# EAGLE design AST1021 (EAGLE 6.3)
DATABASE: ./../../../../../Components/TinyCircuits_Part_Database.txt
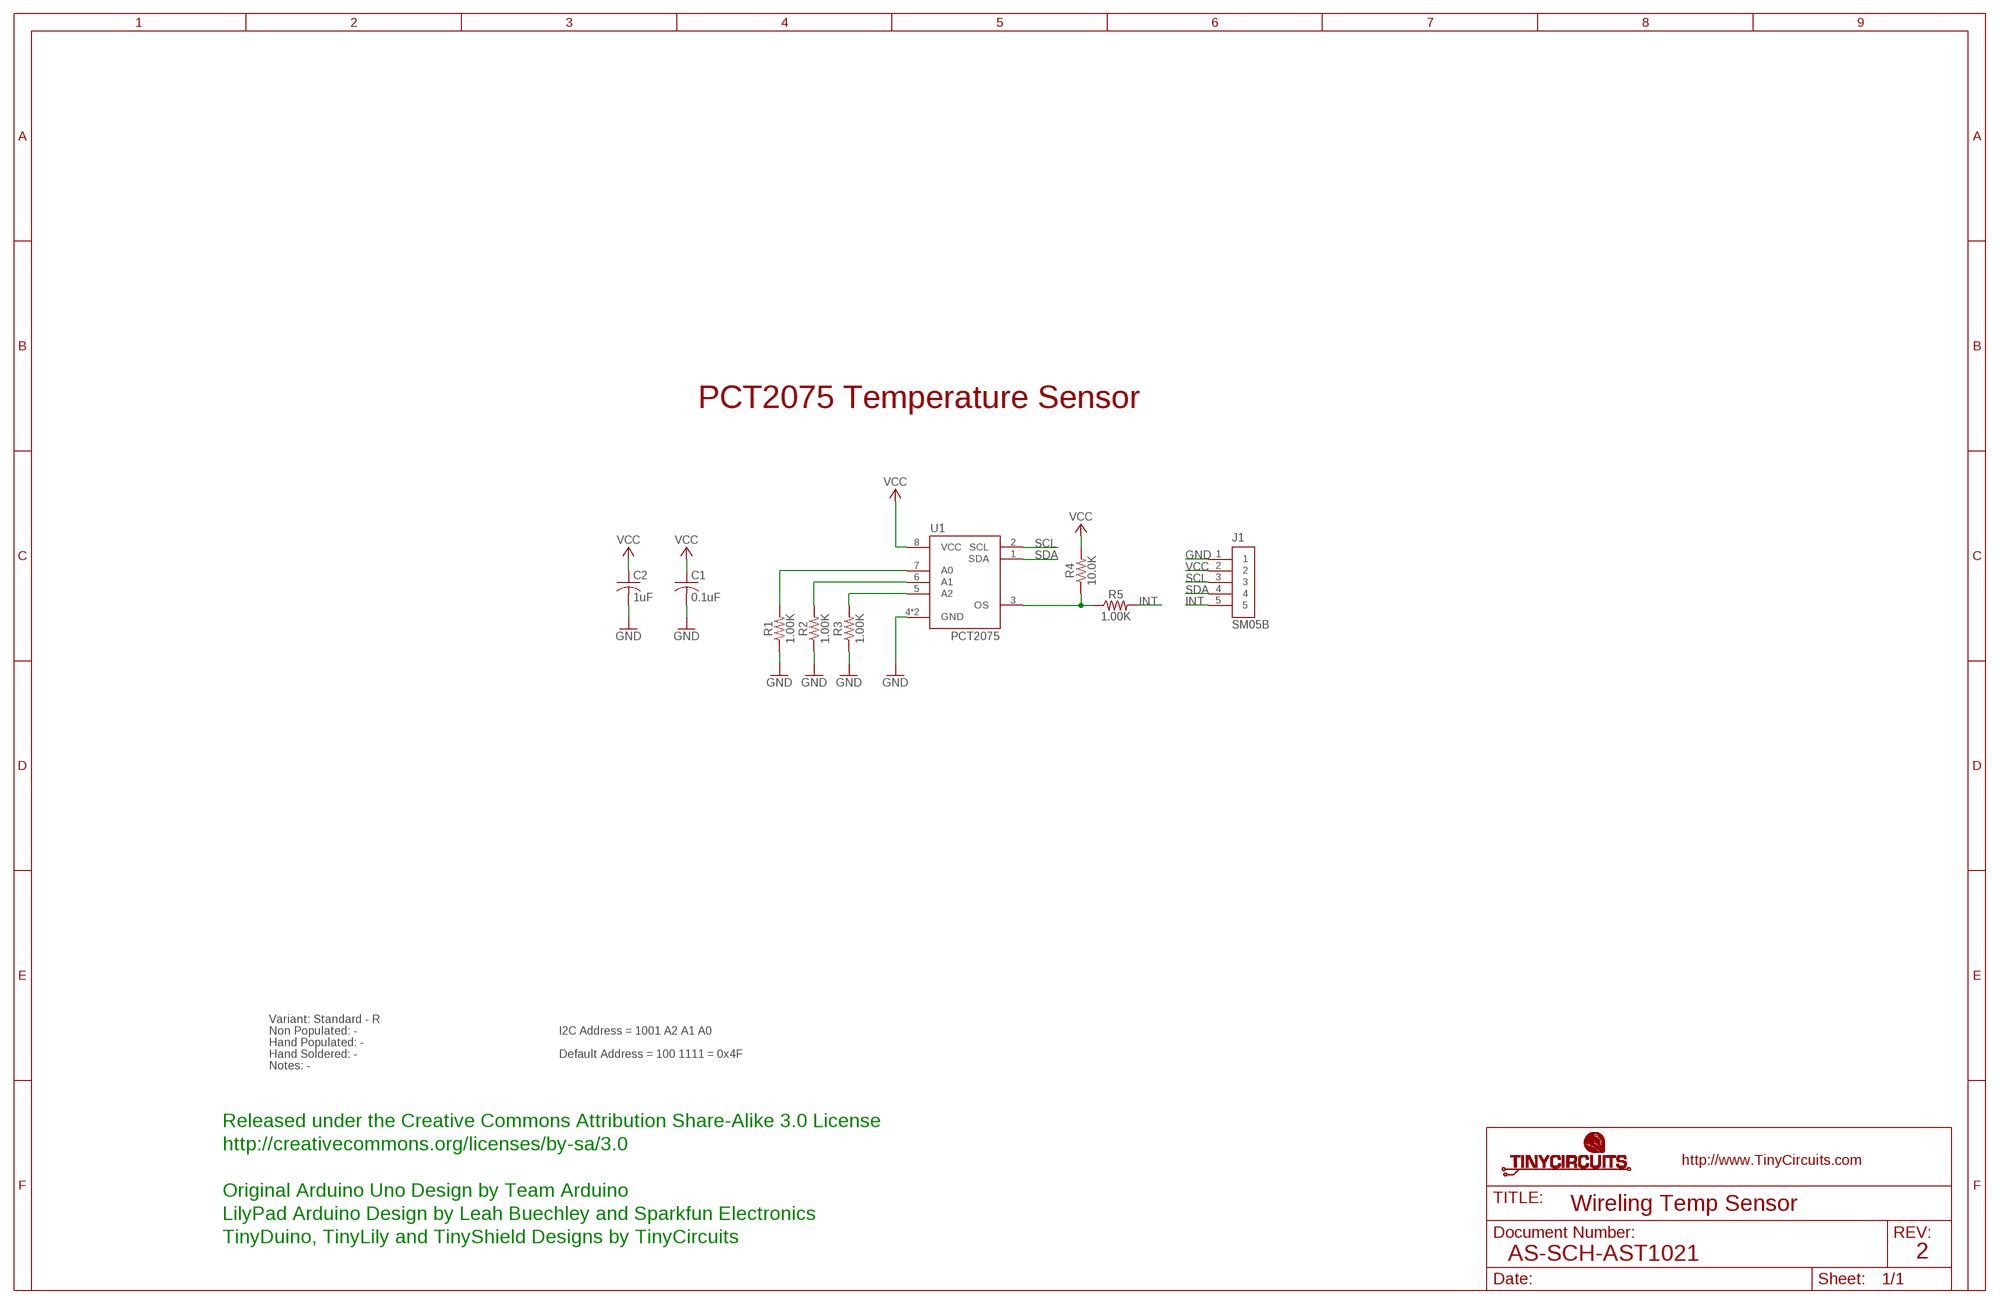
[diagram p0: schematic, sheet 1]

## Parts
C1  0.1uF  AS-ITM-00008  [C0402]
C2  1uF  AS-ITM-00410  [C0603]
J1  SM05B  AS-ITM-00340EDGE  [JST_SH_5X1_EDGE]
R1  1.00K  AS-ITM-00003  [0402]
R2  1.00K  AS-ITM-00003  [0402]
R3  1.00K  AS-ITM-00003  [0402]
R4  10.0K  AS-ITM-00032  [0402]
R5  1.00K  AS-ITM-00003  [0402]
U1  PCT2075  AS-ITM-00325  [HWSON-8]

## Nets
GND: C1.2 C2.2 J1.1 R1.1 R2.1 R3.1 U1.4(GND) U1.GND
GPIO1: R4.1 R5.1 U1.3(OS)
INT: J1.5 R5.2
N$1: R1.2 U1.7(A0)
N$2: R2.2 U1.6(A1)
N$5: R3.2 U1.5(A2)
SCL: J1.3 U1.2(SCL)
SDA: J1.4 U1.1(SDA)
VCC: C1.1 C2.1 J1.2 R4.2 U1.8(VCC)

## Notes on the sheet
- PCT2075 Temperature Sensor
- Variant: Standard - R
- Non Populated: - | I2C Address = 1001 A2 A1 A0
- Hand Populated: -
- Hand Soldered: - | Default Address = 100 1111 = 0x4F
- Notes: -
- Released under the Creative Commons Attribution Share-Alike 3.0 License
- http://creativecommons.org/licenses/by-sa/3.0
- Original Arduino Uno Design by Team Arduino
- Wireling Temp Sensor
- LilyPad Arduino Design by Leah Buechley and Sparkfun Electronics
- TinyDuino, TinyLily and TinyShield Designs by TinyCircuits
- AS-SCH-AST1021 | 2

## Library data of the parts
C1 = tinycircuits:AS-ITM-00008: CAP CER 0.1UF 16V 10% X5R 0402; PARTNO: AS-ITM-00008
C2 = tinycircuits:AS-ITM-00410: CAP CER 1UF 10V X5R 0603; PARTNO: AS-ITM-00410
J1 = tinycircuits:AS-ITM-00340: CONN HEADER SH 5POS SIDE 1MM TIN; PARTNO: AS-ITM-00340; PNPROTATION: 180
R1-R3 R5 = tinycircuits:AS-ITM-00003: RES 1.00K OHM 1/16W 1% 0402; PARTNO: AS-ITM-00003
R4 = tinycircuits:AS-ITM-00032: RES 10.0K OHM 1/16W 1% 0402 SMD; PARTNO: AS-ITM-00032
U1 = tinycircuits:AS-ITM-00325: SENSOR TEMP I2C/SMBUS 8HWSON; PARTNO: AS-ITM-00325

## Net classes
2 gnd: width 0.305 mm, drill 0.559 mm, clearance 0.254 mm

## Board
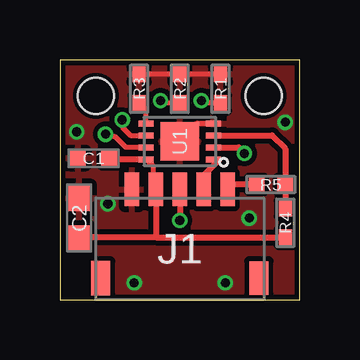
[diagram p1: board, top side]
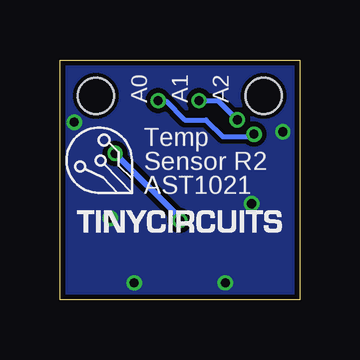
[diagram p2: board, bottom side, seen from below]

Size 10 x 10 mm. Coordinates in mm from the lower left corner, seen from the top.
Outline: 0,0 10,0 10,10 0,10 0,0
Copper layers (1*16): Top 0.035mm / dielectric 1.5mm / Bottom 0.035mm
Design rules "default *": minimum track width 8mil, minimum drill 15mil, track to track 8mil, track to pad 8mil, pad to pad 8mil, via to via 8mil, smd to smd 8mil, copper to edge 8mil, drill to drill 8mil, minimum pad ring 8mil, minimum via ring 5mil, stop-mask expansion 4mil, vias tented up to drill 25mil, thermal gap 10mil
Holes 1.5 mm at 1.5,8.5 8.5,8.5

### Footprints (pad centres in the part's own frame; a part is rotated, then mirrored left to right if it is on the bottom)
C0402 = smd 0.65 x 0.6: 1 -0.65,0; 2 0.65,0
C0603 = smd 1.1 x 1: 1 -0.85,0; 2 0.85,0
JST_SH_5X1_EDGE = smd 0.6 x 1.4: 1 -2,2.475; 2 -1,2.475; 3 0,2.475; 4 1,2.475; 5 2,2.475 | smd 0.8 x 1.4: PAD1 -3.3,-1.225; PAD2 3.3,-1.225
0402 = smd 0.65 x 0.55: 1 -0.6,0; 2 0.6,0
HWSON-8 = smd 0.25 x 0.625: 1 -0.75,-1.4; 2 -0.25,-1.4; 3 0.25,-1.4; 4 0.75,-1.4; 5 0.75,1.4; 6 0.25,1.4; 7 -0.25,1.4; 8 -0.75,1.4 | smd 1.6 x 1.6: GND 0,0

### Placement (x,y rotation side)
C1  1.4,5.9 180 top
C2  0.8,3.4 90 top
J1  5,2.12 0 top
R1  6.7,8.8 270 top
R2  5,8.8 270 top
R3  3.3,8.8 270 top
R4  9.4,3.2 270 top
R5  8.8,4.8 180 top
U1  5,6.6 90 top
U$1  [DOCFIELD-TINYCIRCUITS-PCB]  19,-10 0 top  (outside the outline)

### Tracks (layer width: path | path; a pad name or v marks a point on that pad's centre or on a via)
GND  (via drill 0.38)
  Top 0.203: R1.1 R2.1 R3.1 | U1.4 5.75,7.35 U1.GND
  other vias: 3.1,0.7 6.9,0.7 9.4,7.4 2,4 7.9,3.4 0.7,7
  pour Bottom: 0,10 10,10 10,0 0,0
  pour Top: 0,10 10,10 10,0 0,0
GPIO1
  Top 0.254: U1.3 8.85,6.85 9.4,6.3 R5.1 R4.1
INT
  Top 0.254: R5.2 7.2,4.8 J1.5
N$1  (via drill 0.38)
  Top 0.203: R1.2 6,8.2 v5.9,8.3 | U1.7 2.75,6.35 2.3,6.8 2,6.8 v1.9,6.9
  Bottom 0.203: v5.9,8.3 5.6,8.3 4.8,7.5 3.9,7.5 3.2,6.8 2,6.8 v1.9,6.9
N$2  (via drill 0.38)
  Top 0.203: R2.2 4.3,8.2 v4.2,8.3 | v2.6,7.5 2.6,7.2 2.95,6.85 U1.6
  Bottom 0.203: v4.2,8.3 3.4,8.3 v2.6,7.5
N$5
  Top 0.203: U1.5 3.6,8 R3.2
SCL  (via drill 0.38)
  Top 0.254: J1.3 v5,3.3 | U1.2 7.45,6.35 v7.7,6.1
  Bottom 0.254: v5,3.3 5,3.4 v7.7,6.1
SDA
  Top 0.254: U1.1 6.65,5.85 6,5.2 J1.4
VCC
  Top 0.203: 3.9,4.7 3.9,5.55 U1.8
  Top 0.254: 4,2.6 J1.2 3.9,4.7 | 4,2.6 R4.2 | 4,2.6 0.75,2.6 C2.1 | U1.8 1.9,5.85 C1.1

### Text on the board
bPlace: A2 | A1 | A0 | Temp | Sensor R2 | AST1021
Document: FABRICATION DRAWING | NOTES: | 1. PRINTED CIRCUIT BOARD MADE FROM NEMA GRADE FR-4 EPOXY LAMINATE | WITH 1 OUNCE COPPER PLATING AND .024 THICKNESS. | 2. ALL DIMENSIONS ARE GIVEN IN MILLIMETERS. | 3. CIRCUIT PATHS ARE FOR REFERENCE ONLY. | 4. HOLE SIZES SHOWN ARE FINISHED DIAMETERS AFTER PLATING. | 5. BOARD PLATED USING REFLOW OR SIMILAR METHOD. | 6. BOARD TO HAVE BLUE SOLDER MASK ON PLATED SURFACES USING WET FILM | 7. SILKSCREEN BOARD USING WHITE INK. | SR100 OR SR1010 EPOXY. EQUIVALENT WET OR DRY FILM MAY BE USED. | 8. THE FOLLOWING INFORMATION APPLIES TO THIS BOARD: | * 2 COPPER LAYERS | * .024 BOARD THICKNESS | * REQUIRES TOP SIDE SILKSCREEN | Released under the Creative Commons Attribution Share-Alike 3.0 License | http://creativecommons.org/licenses/by-sa/3.0 | Original Arduino Uno Design by Team Arduino | LilyPad Arduino Design by Leah Buechley and Sparkfun Electronics | TinyDuino, TinyLily and TinyShield Designs by TinyCircuits | Wireling Temp Sensor | AS-PCB-AST1021 | 2